# Altium schematic sheet Power Supplies.SchDoc
size A4
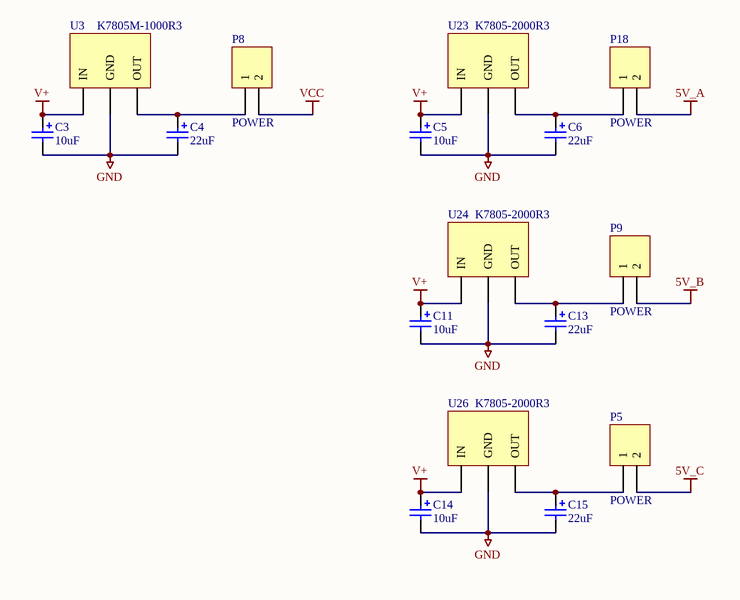
[diagram p0: Power Supplies.SchDoc]

## Parts
C3  10uF  [CAPACITOR 6.3x7]
C4  22uF  [CAPACITOR 5x11]
C5  10uF  [CAPACITOR 6.3x7]
C6  22uF  [CAPACITOR 5x11]
C11  10uF  [CAPACITOR 6.3x7]
C13  22uF  [CAPACITOR 5x11]
C14  10uF  [CAPACITOR 6.3x7]
C15  22uF  [CAPACITOR 5x11]
P5  POWER  [HEADER 1x2]
P8  POWER  [HEADER 1x2]
P9  POWER  [HEADER 1x2]
P18  POWER  [HEADER 1x2]
U3  K7805M-1000R3  [K78xxM-1000R3]
U23  K7805-2000R3  [K78xxM-1000R3L]
U24  K7805-2000R3  [K78xxM-1000R3L]
U26  K7805-2000R3  [K78xxM-1000R3L]

## Nets
5V_A: P18.2
5V_B: P9.2
5V_C: P5.2
GND: C3.2 C4.2 C5.2 C6.2 C11.2 C13.2 C14.2 C15.2 U3.2(GND) U23.2(GND) U24.2(GND) U26.2(GND)
V+: C3.1 C5.1 C11.1 C14.1 U3.1(IN) U23.1(IN) U24.1(IN) U26.1(IN)
VCC: P8.2
NetC4_1: C4.1 P8.1 U3.3(OUT)
NetC6_1: C6.1 P18.1 U23.3(OUT)
NetC13_1: C13.1 P9.1 U24.3(OUT)
NetC15_1: C15.1 P5.1 U26.3(OUT)

## Library data of the parts
C3-C6 C11 C13-C15 = Aluminum 10Dx16Hx5P: Polarized Capacitor (Radial)
  C3 C5 C11 C14: LCSC Part Number: C160183; Value: 10uF
  C4 C6 C13 C15: LCSC Part Number: C512951; Value: 22uF
P5 P8 P9 P18 = Header 2: Header, 2-Pin; LatestRevisionDate: 17-Jul-2002; LatestRevisionNote: Re-released for DXP Platform.; Publisher: Altium Limited
U3 = TRACO 1-2450: RS_PRO K7805M-1000R3; Value: K7805M-1000R3; Supplier: RS-COMPONENTS; Supplier Part Number: 193-4004
U23 U24 U26 = TRACO 1-2450: RS_PRO K7805-2000R3L; Value: K7805-2000R3; Supplier: RS-COMPONENTS; Supplier Part Number: 193-4032